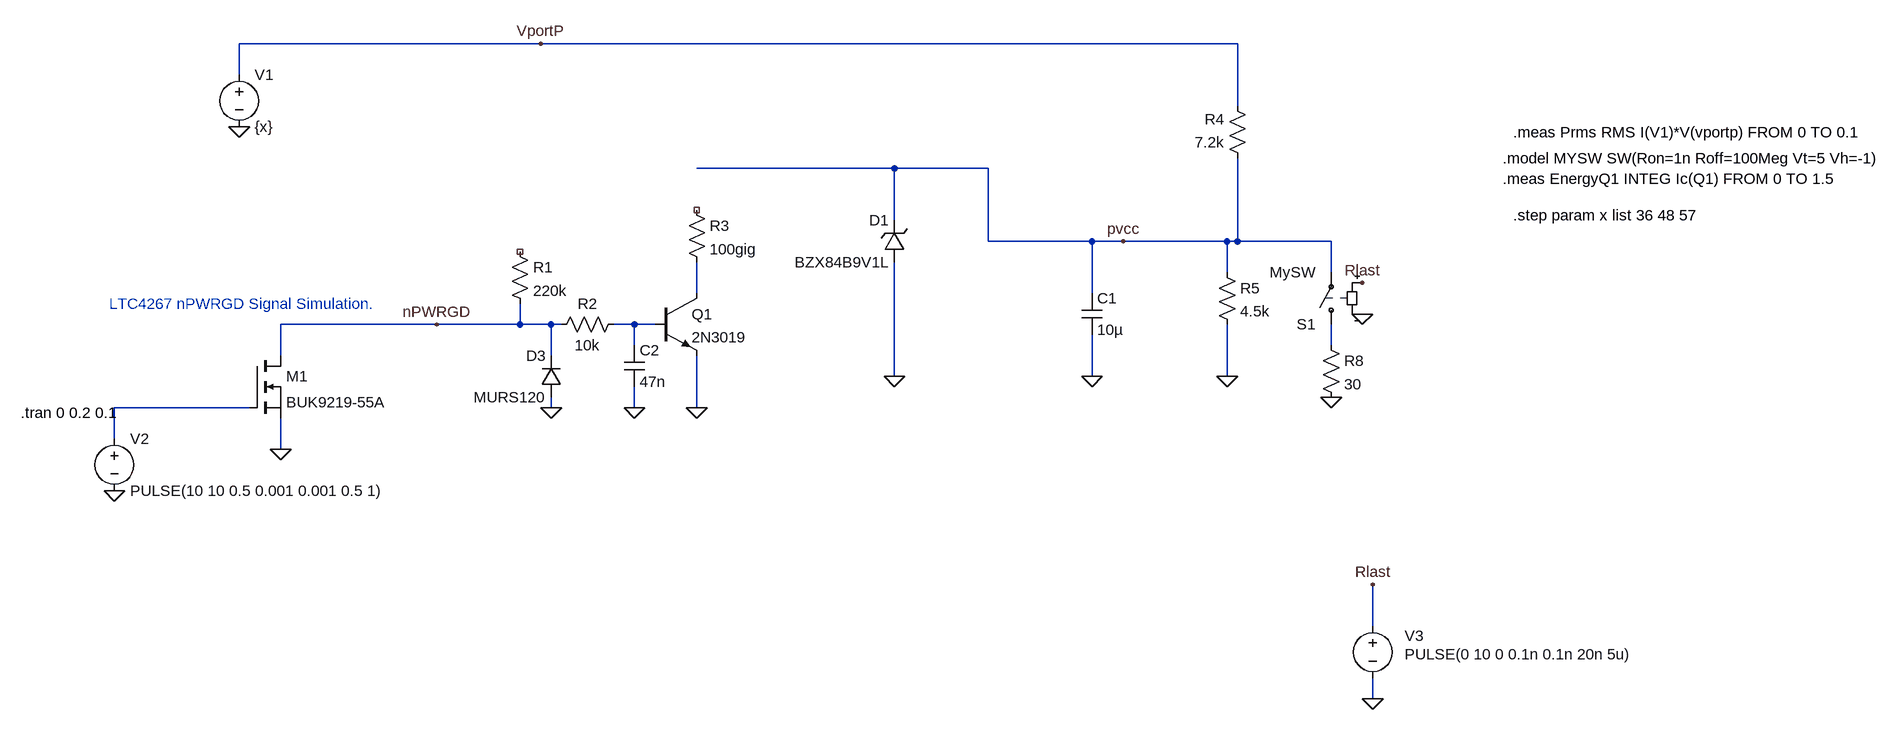
[diagram p0: schematic EinAusschaltLogikAlternativ.asc]
EinAusschaltLogikAlternativ.asc, the LTspice schematic file:
Version 4
SHEET 1 880 680
WIRE -2224 -2528 -2688 -2528
WIRE -1152 -2528 -2224 -2528
WIRE -2688 -2480 -2688 -2528
WIRE -1152 -2432 -1152 -2528
WIRE -1680 -2336 -1984 -2336
WIRE -1536 -2336 -1680 -2336
WIRE -1680 -2256 -1680 -2336
WIRE -1536 -2224 -1536 -2336
WIRE -1376 -2224 -1536 -2224
WIRE -1328 -2224 -1376 -2224
WIRE -1168 -2224 -1328 -2224
WIRE -1152 -2224 -1152 -2352
WIRE -1152 -2224 -1168 -2224
WIRE -1008 -2224 -1152 -2224
WIRE -1168 -2176 -1168 -2224
WIRE -1008 -2176 -1008 -2224
WIRE -1984 -2144 -1984 -2192
WIRE -1376 -2144 -1376 -2224
WIRE -2384 -2096 -2624 -2096
WIRE -2256 -2096 -2256 -2128
WIRE -2256 -2096 -2384 -2096
WIRE -2208 -2096 -2256 -2096
WIRE -2192 -2096 -2208 -2096
WIRE -2080 -2096 -2112 -2096
WIRE -2048 -2096 -2080 -2096
WIRE -2080 -2064 -2080 -2096
WIRE -1008 -2064 -1008 -2096
WIRE -2624 -2048 -2624 -2096
WIRE -2208 -2048 -2208 -2096
WIRE -1680 -2016 -1680 -2192
WIRE -1376 -2016 -1376 -2080
WIRE -1168 -2016 -1168 -2096
WIRE -2672 -1968 -2880 -1968
WIRE -2208 -1968 -2208 -1984
WIRE -2080 -1968 -2080 -2000
WIRE -1984 -1968 -1984 -2048
WIRE -2880 -1920 -2880 -1968
WIRE -2624 -1904 -2624 -1952
WIRE -944 -1632 -944 -1696
WIRE -944 -1520 -944 -1552
FLAG -1680 -2016 0
FLAG -1376 -2016 0
FLAG -1984 -1968 0
FLAG -1328 -2224 pvcc
FLAG -2384 -2096 nPWRGD
FLAG -2224 -2528 VportP
FLAG -2688 -2400 0
FLAG -2880 -1840 0
FLAG -1168 -2016 0
FLAG -2624 -1904 0
FLAG -2080 -1968 0
FLAG -960 -2112 0
FLAG -944 -1520 0
FLAG -944 -1696 Rlast
FLAG -960 -2160 Rlast
FLAG -1008 -1984 0
FLAG -2208 -1968 0
SYMBOL res -2272 -2224 R0
SYMATTR InstName R1
SYMATTR Value 220k
SYMBOL res -2096 -2112 R90
WINDOW 0 0 56 VBottom 2
WINDOW 3 32 56 VTop 2
SYMATTR InstName R2
SYMATTR Value 10k
SYMBOL res -1136 -2336 R180
WINDOW 0 36 76 Left 2
WINDOW 3 36 40 Left 2
SYMATTR InstName R4
SYMATTR Value 7.2k
SYMBOL npn -2048 -2144 R0
SYMATTR InstName Q1
SYMATTR Value 2N3019
SYMBOL zener -1664 -2192 R180
WINDOW 0 24 64 Left 2
WINDOW 3 24 0 Left 2
SYMATTR InstName D1
SYMATTR Value BZX84B9V1L
SYMBOL cap -1392 -2144 R0
SYMATTR InstName C1
SYMATTR Value 10µ
SYMBOL voltage -2688 -2496 R0
WINDOW 123 0 0 Left 0
WINDOW 39 0 0 Left 0
SYMATTR InstName V1
SYMATTR Value {x}
SYMBOL voltage -2880 -1936 R0
WINDOW 123 0 0 Left 0
WINDOW 39 0 0 Left 0
SYMATTR InstName V2
SYMATTR Value PULSE(10 10 0.5 0.001 0.001 0.5 1)
SYMBOL res -1184 -2192 R0
SYMATTR InstName R5
SYMATTR Value 4.5k
SYMBOL nmos -2672 -2048 R0
SYMATTR InstName M1
SYMATTR Value BUK9219-55A
SYMBOL cap -2096 -2064 R0
SYMATTR InstName C2
SYMATTR Value 47n
SYMBOL sw -1008 -2080 R180
SYMATTR InstName S1
SYMATTR Value MySW
SYMBOL voltage -944 -1648 R0
WINDOW 0 49 31 Left 2
WINDOW 3 49 59 Left 2
WINDOW 123 0 0 Left 2
WINDOW 39 0 0 Left 2
SYMATTR InstName V3
SYMATTR Value PULSE(0 10 0 0.1n 0.1n 20n 5u)
SYMBOL res -1024 -2080 R0
SYMATTR InstName R8
SYMATTR Value 30
SYMBOL diode -2192 -1984 R180
WINDOW 0 24 64 Left 2
WINDOW 3 24 0 Left 2
SYMATTR InstName D3
SYMATTR Value MURS120
SYMBOL res -2000 -2288 R0
SYMATTR InstName R3
SYMATTR Value 100gig
TEXT -3024 -1960 Left 2 !.tran 0 0.2 0.1
TEXT -744 -2320 Left 2 !.meas EnergyQ1 INTEG Ic(Q1) FROM 0 TO 1.5
TEXT -2888 -2128 Left 2 ;LTC4267 nPWRGD Signal Simulation.
TEXT -728 -2264 Left 2 !.step param x list 36 48 57
TEXT -744 -2352 Left 2 !.model MYSW SW(Ron=1n Roff=100Meg Vt=5 Vh=-1)
TEXT -728 -2392 Left 2 !.meas Prms RMS I(V1)*V(vportp) FROM 0 TO 0.1

The netlist it stands for:
* EinAusschaltLogikAlternativ.asc
R1 NC_01 nPWRGD 220k
R2 N002 nPWRGD 10k
R4 pvcc VportP 7.2k
Q1 N001 N002 0 0 2N3019
D1 0 pvcc BZX84B9V1L
C1 pvcc 0 10µ
V1 VportP 0 {x}
V2 N004 0 PULSE(10 10 0.5 0.001 0.001 0.5 1)
R5 pvcc 0 4.5k
M1 nPWRGD N004 0 0 BUK9219-55A
C2 N002 0 47n
S1 N003 pvcc Rlast 0 MySW
V3 Rlast 0 PULSE(0 10 0 0.1n 0.1n 20n 5u)
R8 N003 0 30
D3 0 nPWRGD MURS120
R3 NC_02 N001 100gig
.model D D
.lib standard.dio
.model NPN NPN
.model PNP PNP
.lib standard.bjt
.model NMOS NMOS
.model PMOS PMOS
.lib standard.mos
.tran 0 0.2 0.1
.meas EnergyQ1 INTEG Ic(Q1) FROM 0 TO 1.5
* LTC4267 nPWRGD Signal Simulation.
.step param x list 36 48 57
.model MYSW SW(Ron=1n Roff=100Meg Vt=5 Vh=-1)
.meas Prms RMS I(V1)*V(vportp) FROM 0 TO 0.1
.backanno
.end